# Altium schematic sheet InputChannel_1.SchDoc
size A3; DocumentNumber: 1; SheetNumber: 1; SheetTotal: 3; PageSetup: Record=PageOptions|CenterHorizontal=True|CenterVertical=True|PrintScale=0.97|XCorrection=1.00|YCorrection=1.00|PrintKind=1|BorderSize=5000000|LeftOffset=0|BottomOffset=0|Orientation=2|PaperLength=2970|PaperWidth=2100|Scale=100|PaperSource=7|PrintQuality=600|MediaType=1|DitherType=10|PaperKind=A4|PrintScaleMode=1
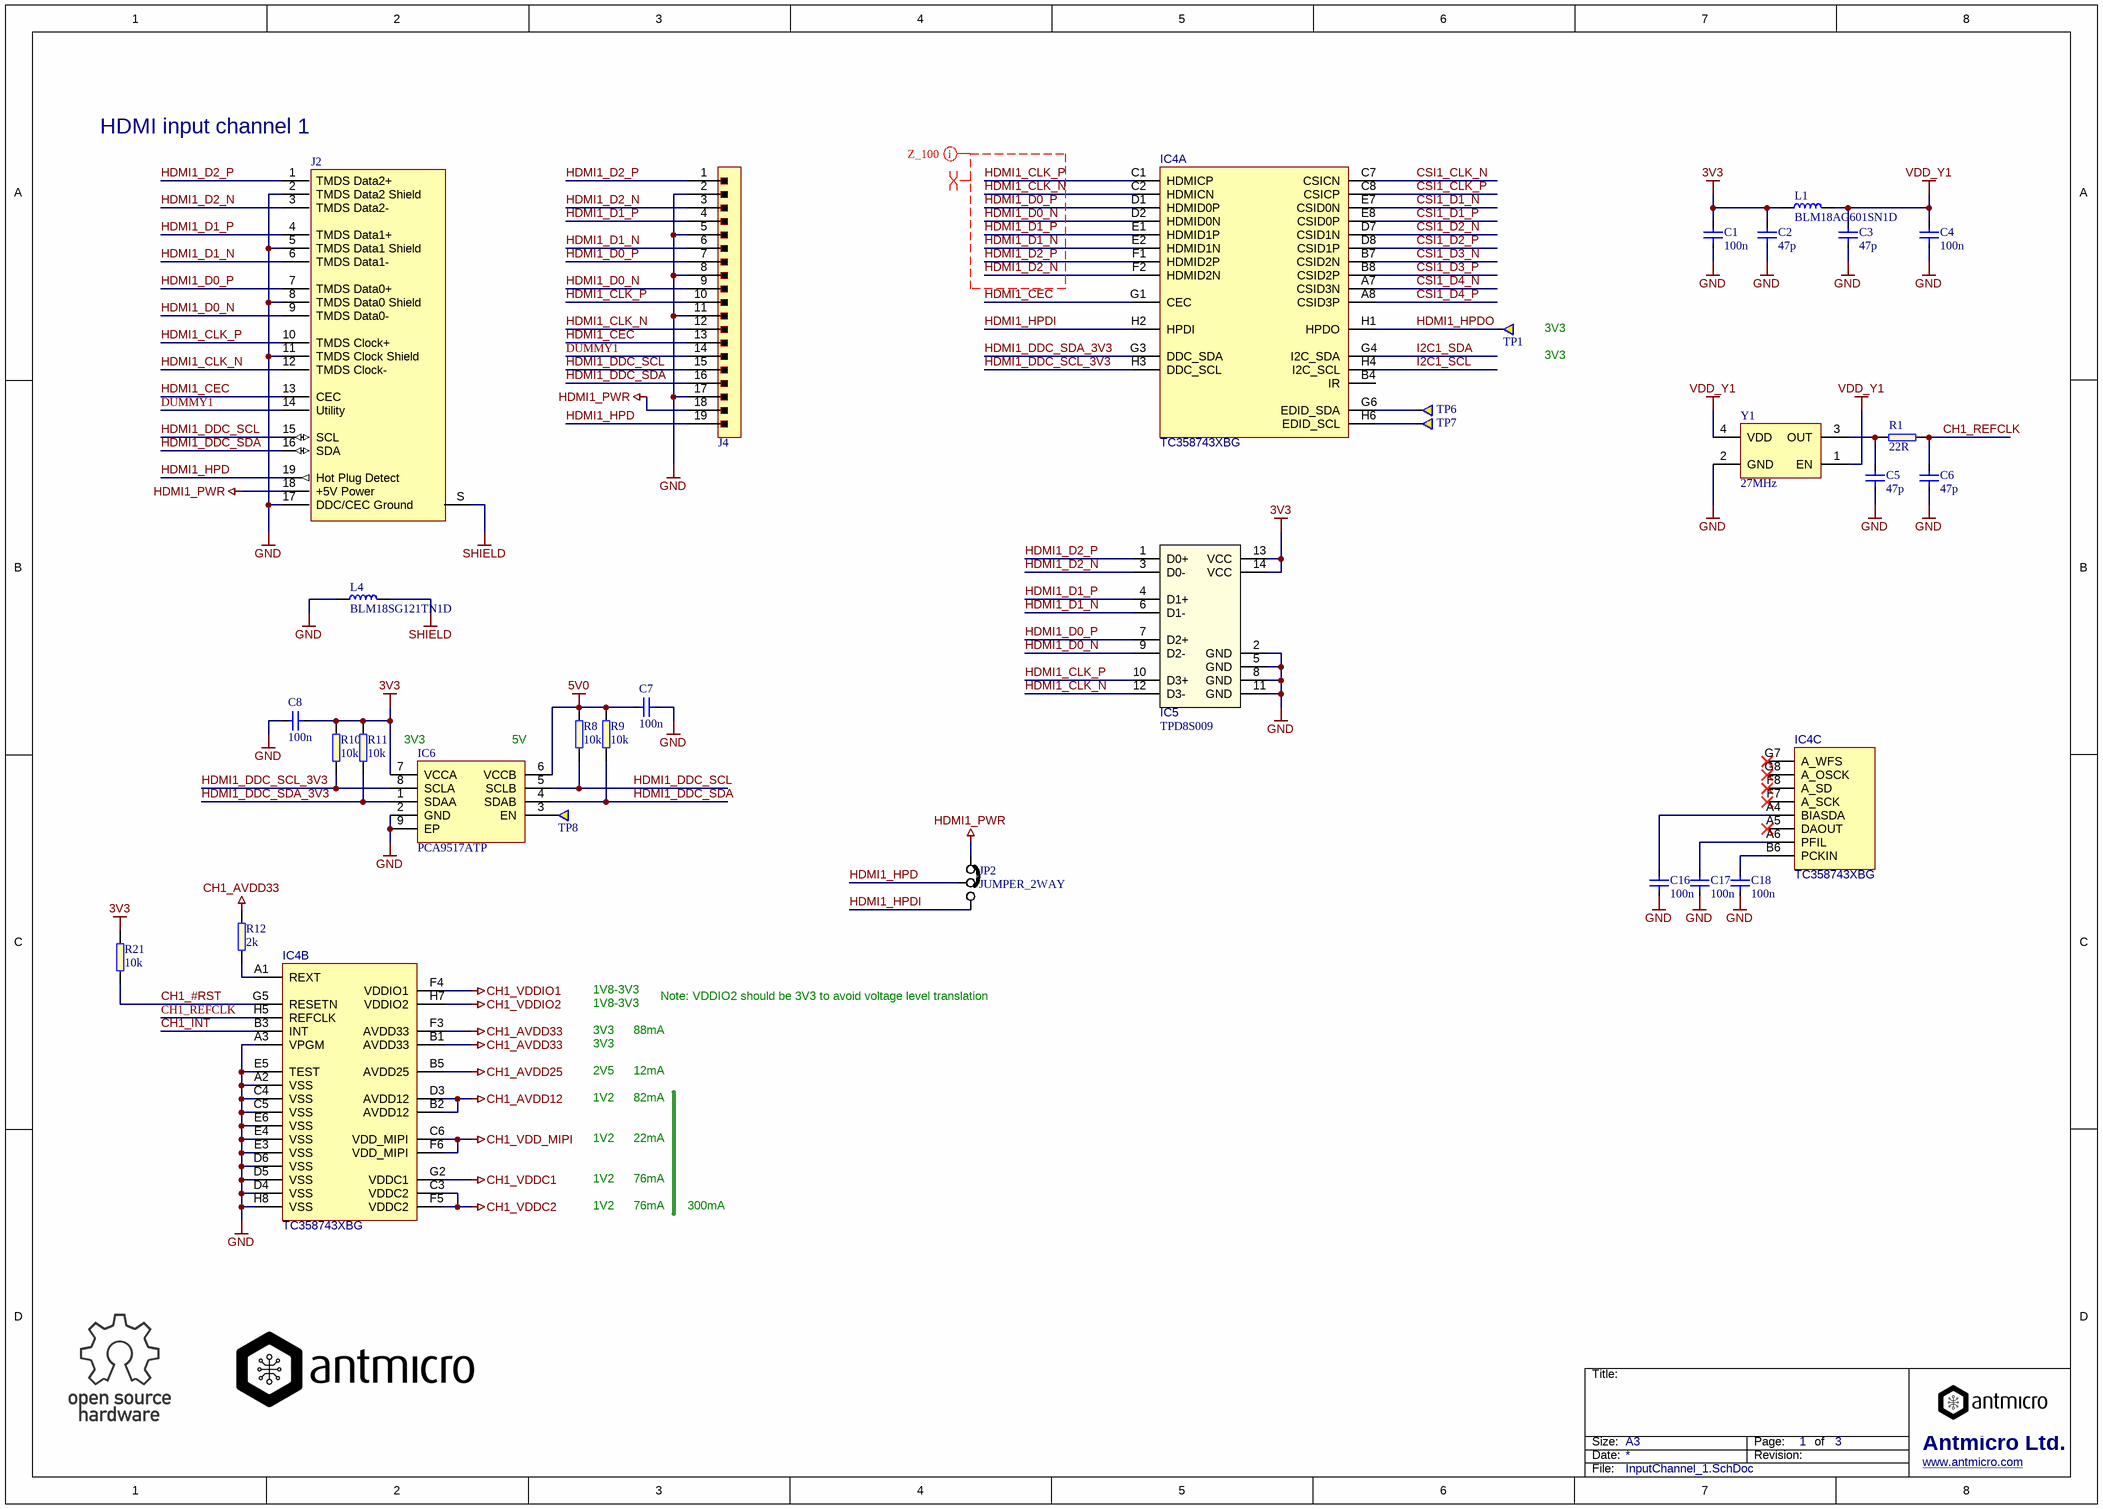
[diagram p0: InputChannel_1.SchDoc]

## Parts
C1  100n  [0402]
C2  47p  [0402]
C3  47p  [0402]
C4  100n  [0402]
C5  47p  [0402]
C6  47p  [0402]
C7  100n  [0402]
C8  100n  [0402]
C16  100n  [0402]
C17  100n  [0402]
C18  100n  [0402]
IC4  TC358743XBG  [TC358743XBG]  (parts A,B,C of 3)
IC5  TPD8S009  [SON-15]
IC6  PCA9517ATP  [PCA9517ATP]
J2  (no value)  [Molex_HDMI_471511001]
J4  Molex-505110-1992  [CON-Molex-505110-1992]  (value not drawn)
JP2  JUMPER_2WAY  [JUMPER_2WAY]  (no BOM)
L1  BLM18AG601SN1D  [0603]
L4  BLM18SG121TN1D  [0603]
R1  22R  [0402]
R8  10k  [0402]
R9  10k  [0402]
R10  10k  [0402]
R11  10k  [0402]
R12  2k  [0603]
R21  10k  [0402]
TP1  Testpad  [TP-R-1]  (value not drawn)  (no BOM)
TP6  Testpad  [TP-R-1]  (value not drawn)  (no BOM)
TP7  Testpad  [TP-R-1]  (value not drawn)  (no BOM)
TP8  Testpad  [TP-R-1]  (value not drawn)  (no BOM)
Y1  27MHz  [TXC_7C]

## Nets
3V3: C1.2 C2.2 C8.1 IC5.13(VCC) IC5.14(VCC) IC6.7(VCCA) L1.1 R10.2 R11.2 R21.2
5V0: C7.2 IC6.6(VCCB) R8.2 R9.2
CH1_AVDD12: IC4.B2(AVDD12) IC4.D3(AVDD12)
CH1_AVDD25: IC4.B5(AVDD25)
CH1_AVDD33: IC4.B1(AVDD33) IC4.F3(AVDD33) R12.2
CH1_VDD_MIPI: IC4.C6(VDD_MIPI) IC4.F6(VDD_MIPI)
CH1_VDDC1: IC4.G2(VDDC1)
CH1_VDDC2: IC4.C3(VDDC2) IC4.F5(VDDC2)
CH1_VDDIO1: IC4.F4(VDDIO1)
CH1_VDDIO2: IC4.H7(VDDIO2)
GND: C1.1 C2.1 C3.1 C4.1 C5.1 C6.1 C7.1 C8.2 C16.1 C17.1 C18.1 IC4.A2(VSS) IC4.A3(VPGM) IC4.C4(VSS) IC4.C5(VSS) IC4.D4(VSS) IC4.D5(VSS) IC4.D6(VSS) IC4.E3(VSS) IC4.E4(VSS) IC4.E5(TEST) IC4.E6(VSS) IC4.H8(VSS) IC5.2(GND) IC5.5(GND) IC5.8(GND) IC5.11(GND) IC6.2(GND) IC6.9(EP) J2.2(TMDS_Data2_Shield) J2.5(TMDS_Data1_Shield) J2.8(TMDS_Data0_Shield) J2.11(TMDS_Clock_Shield) J2.17(DDC/CEC_Ground) J4.2 J4.5 J4.8 J4.11 J4.17 L4.1 Y1.2(GND)
HDMI1_PWR: J2.18(+5V_Power) J4.18 JP2.1
SHIELD: J2.S(SH) L4.2
VDD_Y1: C3.2 C4.2 L1.2 Y1.1(EN) Y1.4(VDD)
CH1_#RST: IC4.G5(RESETN) R21.1
CH1_INT: IC4.B3(INT)
CH1_REFCLK: C6.2 IC4.H5(REFCLK) R1.2
CSI1_CLK_N: IC4.C7(CSICN)
CSI1_CLK_P: IC4.C8(CSICP)
CSI1_D1_N: IC4.E7(CSID0N)
CSI1_D1_P: IC4.E8(CSID0P)
CSI1_D2_N: IC4.D7(CSID1N)
CSI1_D2_P: IC4.D8(CSID1P)
CSI1_D3_N: IC4.B7(CSID2N)
CSI1_D3_P: IC4.B8(CSID2P)
CSI1_D4_N: IC4.A7(CSID3N)
CSI1_D4_P: IC4.A8(CSID3P)
DUMMY1: J2.14(Utility) J4.14
HDMI1_CEC: IC4.G1(CEC) J2.13(CEC) J4.13
HDMI1_CLK_N: IC4.C2(HDMICN) IC5.12(D3-) J2.12(TMDS_Clock-) J4.12
HDMI1_CLK_P: IC4.C1(HDMICP) IC5.10(D3+) J2.10(TMDS_Clock+) J4.10
HDMI1_D0_N: IC4.D2(HDMID0N) IC5.9(D2-) J2.9(TMDS_Data0-) J4.9
HDMI1_D0_P: IC4.D1(HDMID0P) IC5.7(D2+) J2.7(TMDS_Data0+) J4.7
HDMI1_D1_N: IC4.E2(HDMID1N) IC5.6(D1-) J2.6(TMDS_Data1-) J4.6
HDMI1_D1_P: IC4.E1(HDMID1P) IC5.4(D1+) J2.4(TMDS_Data1+) J4.4
HDMI1_D2_N: IC4.F2(HDMID2N) IC5.3(D0-) J2.3(TMDS_Data2-) J4.3
HDMI1_D2_P: IC4.F1(HDMID2P) IC5.1(D0+) J2.1(TMDS_Data2+) J4.1
HDMI1_DDC_SCL: IC6.5(SCLB) J2.15(SCL) J4.15 R8.1
HDMI1_DDC_SCL_3V3: IC4.H3(DDC_SCL) IC6.8(SCLA) R10.1
HDMI1_DDC_SDA: IC6.4(SDAB) J2.16(SDA) J4.16 R9.1
HDMI1_DDC_SDA_3V3: IC4.G3(DDC_SDA) IC6.1(SDAA) R11.1
HDMI1_HPD: J2.19(Hot_Plug_Detect) J4.19 JP2.2
HDMI1_HPDI: IC4.H2(HPDI) JP2.3
HDMI1_HPDO: IC4.H1(HPDO) TP1.1
I2C1_SCL: IC4.H4(I2C_SCL)
I2C1_SDA: IC4.G4(I2C_SDA)
NetC5_2: C5.2 R1.1 Y1.3(OUT)
NetC16_2: C16.2 IC4.A4(BIASDA)
NetC17_2: C17.2 IC4.A6(PFIL)
NetC18_2: C18.2 IC4.B6(PCKIN)
NetIC4_A1: IC4.A1(REXT) R12.1
NetIC4_G6: IC4.G6(EDID_SDA) TP6.1
NetIC4_H6: IC4.H6(EDID_SCL) TP7.1
NetIC6_3: IC6.3(EN) TP8.1

Not connected (* = marked no-connect by the designer): IC4 A5(DAOUT)* B4(IR) F7(A_SCK)* F8(A_SD)* G7(A_WFS)* G8(A_OSCK)*

## Layout directives
net class Z_100: HDMI1_CLK_N, HDMI1_CLK_P, HDMI1_D0_N, HDMI1_D0_P, HDMI1_D1_N, HDMI1_D1_P, HDMI1_D2_N, HDMI1_D2_P
differential pair: HDMI1_CLK_N, HDMI1_CLK_P, HDMI1_D0_N, HDMI1_D0_P, HDMI1_D1_N, HDMI1_D1_P, HDMI1_D2_N, HDMI1_D2_P

## Notes on the sheet
- (near J2) HDMI input channel 1
- (near TP1) 3V3
- 3V3
- (near IC6) 5V
- 1V8-3V3
- 88mA
- Note: VDDIO2 should be 3V3 to avoid voltage level translation
- 2V5
- 1V2
- 82mA
- 12mA
- 76mA
- 22mA
- 300mA
- Title:
- Size:
- Date:
- A3
- Revision:
- Page:
- of
- Antmicro Ltd.
- File:
- www.antmicro.com

## Library data of the parts
C1 C4 C7 C8 C16-C18 = C_100n_0402: MLCC SMT Capacitor 100nF 0402; Manufacturer: MULTICOMP; MPN: MC0402X104M100CT; Part Number: C_100n_0402; Value: 100n; Supplier 1: Farnell; Supplier Part Number 1: 2309011
C2 C3 C5 C6 = C_47p_0402: MLCC SMT Capacitor 47pF 0402; Manufacturer: KEMET; MPN: C0402C470J5GACTU; Part Number: C_47p_0402; Value: 47p; Supplier 1: Farnell; Supplier Part Number 1: 1414592
IC4 = TC358743XBG: Toshiba TC358743XBG HDMI-CSI bridge; Part Number: TC358743XBG; Value: TC358743XBG; Manufacturer: Toshiba; MPN: TC358743XBG
IC5 = TPD8S009: 8-Channel ESD Protection for DisplayPort and HDMI; Manufacturer: TEXAS INSTRUMENTS; MPN: TPD8S009DSMR; Part Number: TPD8S009; Value: TPD8S009; Supplier 1: Farnell; Supplier Part Number 1: 1772003
IC6 = PCA9517ATP: I2C BUS REPEATER W/ LEVEL TRANS, HWSON-8; Manufacturer: NXP; Part Number: PCA9517ATP; Value: PCA9517ATP; Supplier 1: Digi-Key; Supplier Part Number 1: 568-9816-1-ND; MPN: PCA9517ATP
J2 = CON-Molex-471511001: Header right angle HDMI; Manufacturer: MOLEX; MPN: 47151-1001; Part Number: CON-Molex-471511001; Supplier 1: Farnell; Supplier Part Number 1: 1516661
J4 = CON-Molex-505110-1992: FPC socket 19 pins; Manufacturer: Molex; Part Number: CON-Molex-505110-1992; Supplier Part Number 1: WM12375CT-ND; Value: Molex-505110-1992; Supplier 1: Digi-Key; MPN: 505110-1992
JP2 = Jumper 2 way: Solder jumper; Part Number: Jumper 2 way
L1 = BLM18AG601SN1D: Ferrite Bead, 600 ohm, 0603 [1608 Metric], BLM18A Series, 500 mA, 0.38 ohm, ± 25%; Manufacturer: MURATA; Part Number: BLM18AG601SN1D; Value: BLM18AG601SN1D; Supplier 1: Farnell; Supplier Part Number 1: 1515679; MPN: BLM18AG601SN1D
L4 = BLM18SG121TN1D: FERRITE BEAD, 0.025OHM, 3A, 0603; Manufacturer: MURATA; Part Number: BLM18SG121TN1D; Value: BLM18SG121TN1D; Supplier 1: Farnell; Supplier Part Number 1: 1515752; MPN: BLM18SG121TN1D
R1 = R_22R_0402: SMT Resistor 22R 0402; Manufacturer: VISHAY; MPN: CRCW040222R0FKED; Part Number: R_22R_0402; Value: 22R; Supplier 1: Farnell; Supplier Part Number 1: 1469697
R8-R11 R21 = R_10k_0402: SMT Resistor 0402; Manufacturer: MULTICOMP; MPN: MCMR04X1002FTL; Part Number: R_10k_0402; Value: 10k; Supplier 1: Farnell; Supplier Part Number 1: 2072517
R12 = R_2k_0603: SMT Resistor 2k 0603; Manufacturer: MULTICOMP; MPN: MCMR06X2001FTL; Part Number: R_2k_0603; Value: 2k; Supplier 1: Farnell; Supplier Part Number 1: 2073418
TP1 TP6-TP8 = TP-R-1: Testpad, round, 1mm; Part Number: TP-R-1
Y1 = 7C-27.000MBB-T: OSC, 27.000MHZ, 3.3V, SMD, 5.0X3.2; Manufacturer: TXC; Part Number: 7C-27.000MBB-T; Value: 27MHz; Supplier 1: Farnell; Supplier Part Number 1: 1842035; MPN: 7C-27.000MBB-T